# EAGLE schematic marqee_attiny85_new (EAGLE 8.6.0)
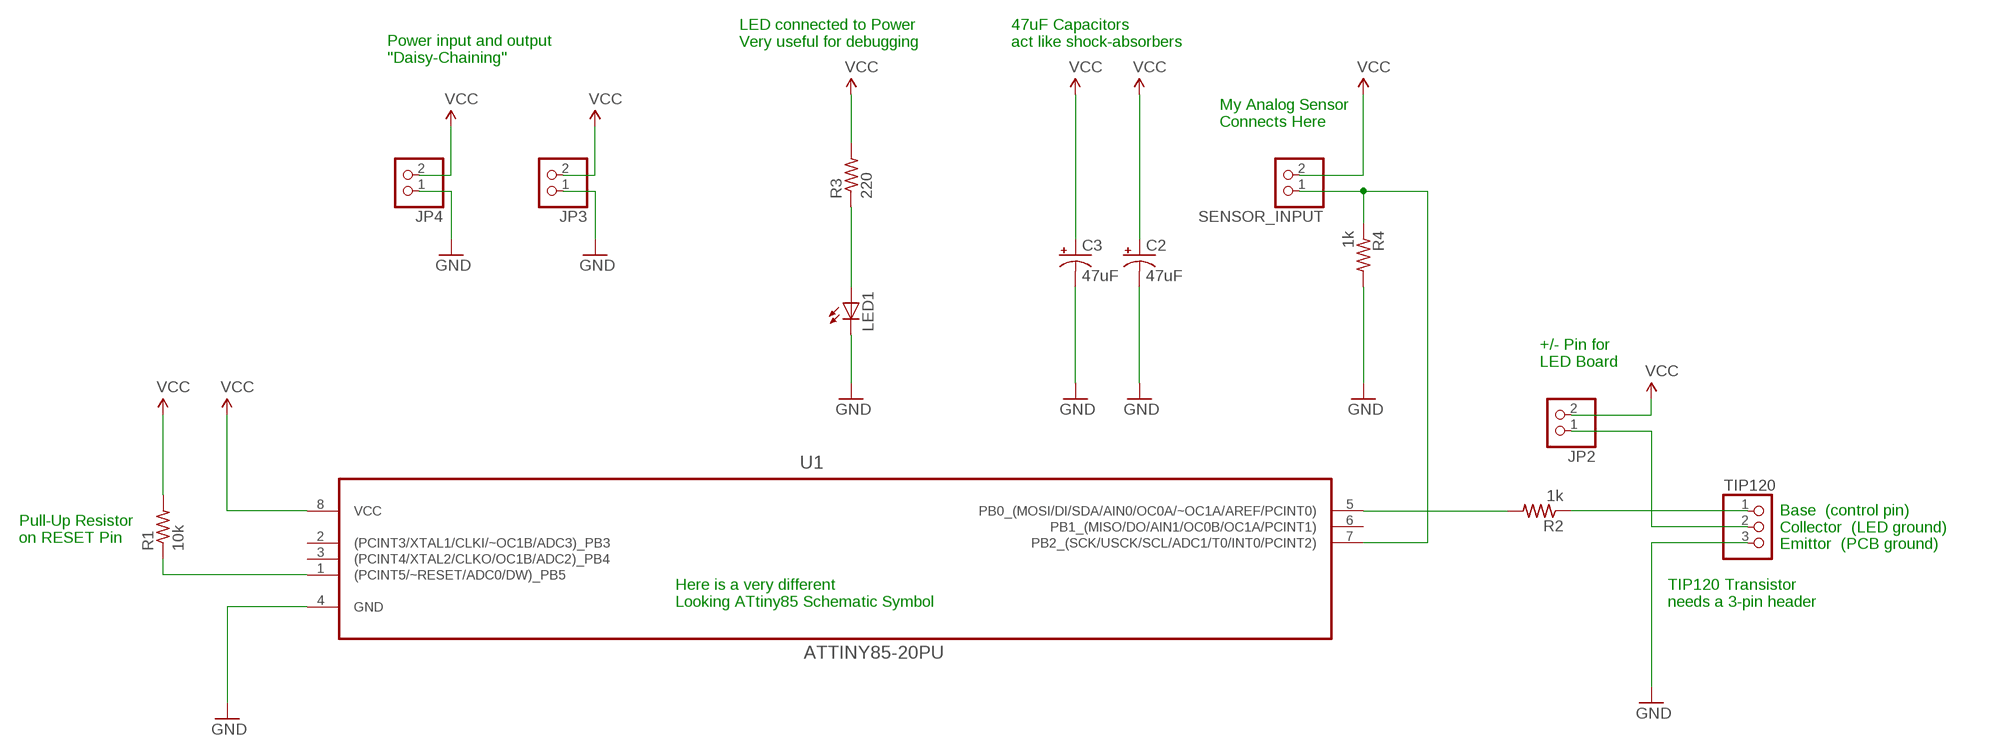
[diagram p0: schematic, sheet 1]

## Parts
C2  47uF  CPOL-USE5-8.5  [E5-8,5]
C3  47uF  CPOL-USE5-8.5  [E5-8,5]
JP2  PINHD-1X2  [1X02]
JP3  PINHD-1X2  [1X02]
JP4  PINHD-1X2  [1X02]
LED1  LED5MM  [LED5MM]
R1  10k  R-US_0207/10  [0207/10]
R2  1k  R-US_0207/10  [0207/10]
R3  220  R-US_0207/10  [0207/10]
R4  1k  R-US_0207/10  [0207/10]
SENSOR_INPUT  PINHD-1X2  [1X02]
TIP120  PINHD-1X3  [1X03]
U1  ATTINY85-20PU  [DIP254P762X533-8]

## Nets
ANALOG_SENSOR_IN: R4.1 SENSOR_INPUT.1 U1.7(PB2_(SCK/USCK/SCL/ADC1/T0/INT0/PCINT2))
GND: C2.- C3.- JP3.1 JP4.1 LED1.K(C) R4.2 TIP120.3 U1.4(GND)
N$1: R1.1 U1.1((PCINT5/~RESET/ADC0/DW)_PB5)
N$2: R2.1 TIP120.1
N$3: LED1.A R3.1
N$4: R2.2 U1.5(PB0_(MOSI/DI/SDA/AIN0/OC0A/~OC1A/AREF/PCINT0))
THING: JP2.1 TIP120.2
VCC: C2.+ C3.+ JP2.2 JP3.2 JP4.2 R1.2 R3.2 SENSOR_INPUT.2 U1.8(VCC)
Unconnected: U1.2((PCINT3/XTAL1/CLKI/~OC1B/ADC3)_PB3) U1.3((PCINT4/XTAL2/CLKO/OC1B/ADC2)_PB4) U1.6(PB1_(MISO/DO/AIN1/OC0B/OC1A/PCINT1))

## Notes on the sheet
- LED connected to Power
  Very useful for debugging
- 47uF Capacitors
  act like shock-absorbers
- Power input and output
  "Daisy-Chaining"
- My Analog Sensor
  Connects Here
- +/- Pin for
  LED Board
- Base  (control pin)
  Collector  (LED ground)
  Emittor  (PCB ground)
- Pull-Up Resistor
  on RESET Pin
- Here is a very different
  Looking ATtiny85 Schematic Symbol
- TIP120 Transistor
  needs a 3-pin header

## Library data of the parts
C2 C3 = rcl:CPOL-US: POLARIZED CAPACITOR, American symbol; SPICEPREFIX: C
JP2-JP4 SENSOR_INPUT = pinhead:PINHD-1X2: PIN HEADER
LED1 = led:LED: LED OSRAM: - CHIPLED LG R971, LG N971, LY N971, LG Q971, LY Q971, LO R971, LY R971 LH N974, LH R974 LS Q976, LO Q976, LY Q976 LO Q996 - Hyper CHIPLED LW Q18S LB Q993, LB Q99A, LB R99A - SideLED LS A670, LO A670, LY A670, LG A670, LP A670 LB A673, LV A673, LT A673, LW A673 LH A674 LY A675 LS A676, LA A676, LO A676, LY A676, LW A676 LS A679, LY A679, LG A679 - Hyper Micro SIDELED® LS Y876, LA Y876, LO Y876, LY Y876 LT Y87S - SmartLED LW L88C, LW L88S LB L89C, LB L89S, LG L890 LS L89K, LO L89K, LY L89K LS L896, LA L896, LO L896, LY L896 - TOPLED LS T670, LO T670, LY T670, LG T670, LP T670 LSG T670, LSP T670, LSY T670, LOP T670, LYG T670 LG T671, LOG T671, LSG T671 LB T673, LV T673, LT T673, LW T673 LH T674 LS T676, LA T676, LO T676, LY T676, LB T676, LH T676, LSB T676, LW T676 LB T67C, LV T67C, LT T67C, LS T67K, LO T67K, LY T67K, LW E67C LS E67B, LA E67B, LO E67B, LY E67B, LB E67C, LV E67C, LT E67C LW T67C LS T679, LY T679, LG T679 LS T770, LO T770, LY T770, LG T770, LP T770 LB T773, LV T773, LT T773, LW T773 LH T774 LS E675, LA E675, LY E675, LS T675 LS T776, LA T776, LO T776, LY T776, LB T776 LHGB T686 LT T68C, LB T68C - Hyper Mini TOPLED® LB M676 - Mini TOPLED Santana® LG M470 LS M47K, LO M47K, LY M47K Source: http://www.osram.convergy.de LUXEON: - LUMILED® LXK2-PW12-R00, LXK2-PW12-S00, LXK2-PW14-U00, LXK2-PW14-V00 LXK2-PM12-R00, LXK2-PM12-S00, LXK2-PM14-U00 LXK2-PE12-Q00, LXK2-PE12-R00, LXK2-PE12-S00, LXK2-PE14-T00, LXK2-PE14-U00 LXK2-PB12-K00, LXK2-PB12-L00, LXK2-PB12-M00, LXK2-PB14-N00, LXK2-PB14-P00, LXK2-PB14-Q00 LXK2-PR12-L00, LXK2-PR12-M00, LXK2-PR14-Q00, LXK2-PR14-R00 LXK2-PD12-Q00, LXK2-PD12-R00, LXK2-PD12-S00 LXK2-PH12-R00, LXK2-PH12-S00 LXK2-PL12-P00, LXK2-PL12-Q00, LXK2-PL12-R00 Source: www.luxeon.com KINGBRIGHT: KA-3528ASYC Source: www.kingbright.com
R1-R4 = resistor:R-US_: RESISTOR, American symbol
TIP120 = pinhead:PINHD-1X3: PIN HEADER
U1 = Atmel_By_element14_Batch_1:ATTINY85-20PU: 8-bit Microcontroller with In-System Programmable Flash; MPN: ATTINY85-20PU; OC_FARNELL: 1455162; OC_NEWARK: 58M3796; PACKAGE: PDIP-8; SUPPLIER: Atmel